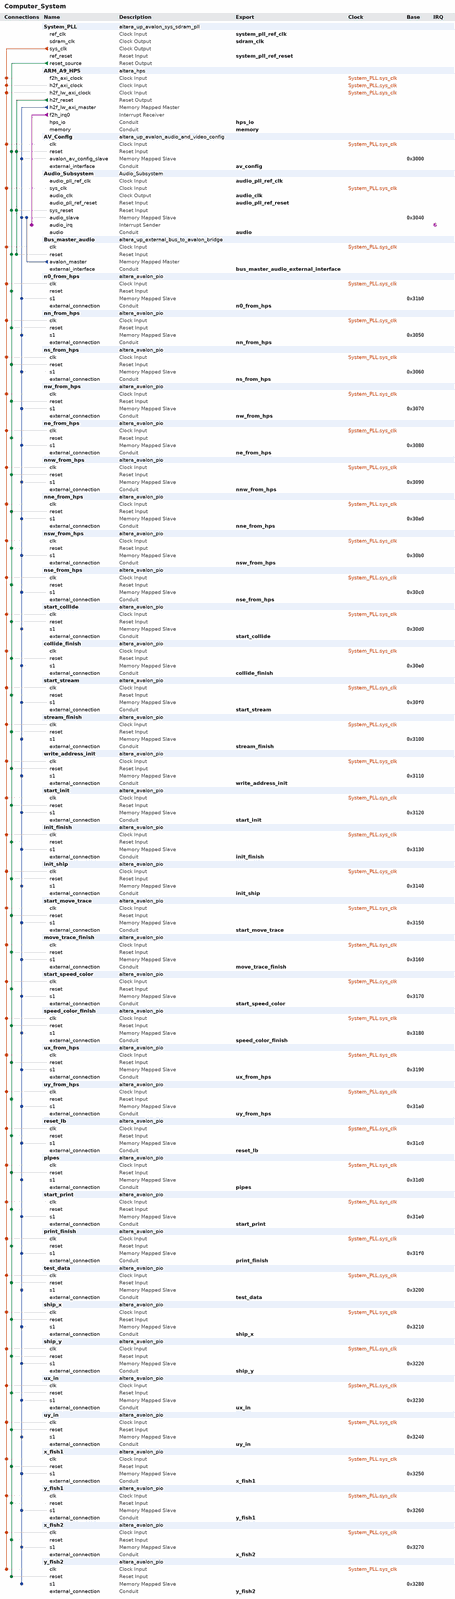
[diagram p0: system contents, whole]
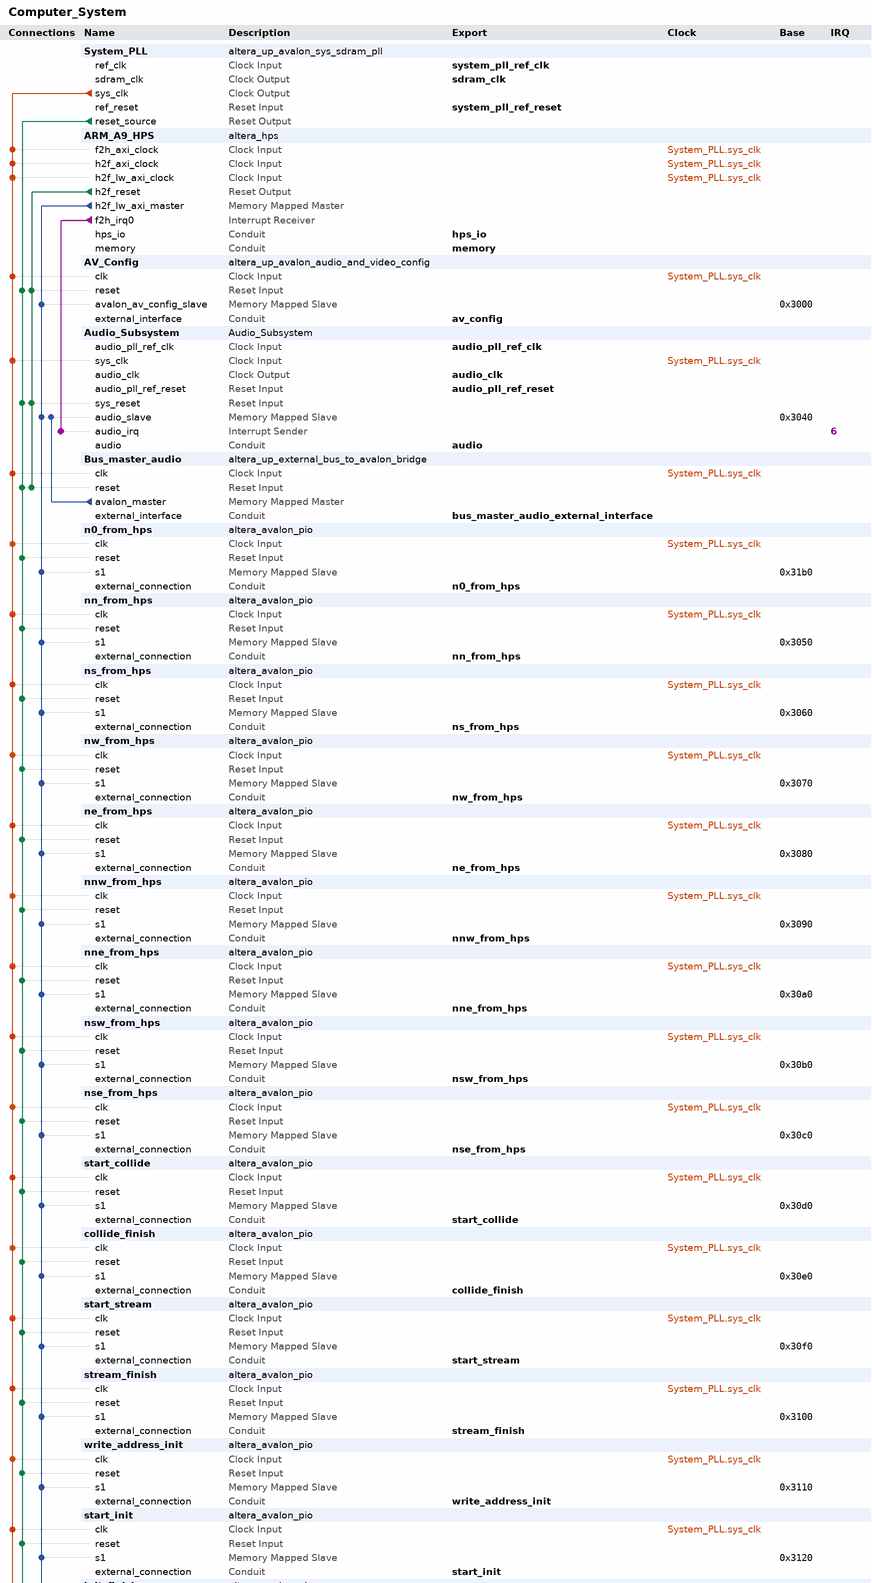
[diagram p1: system contents, upper part]
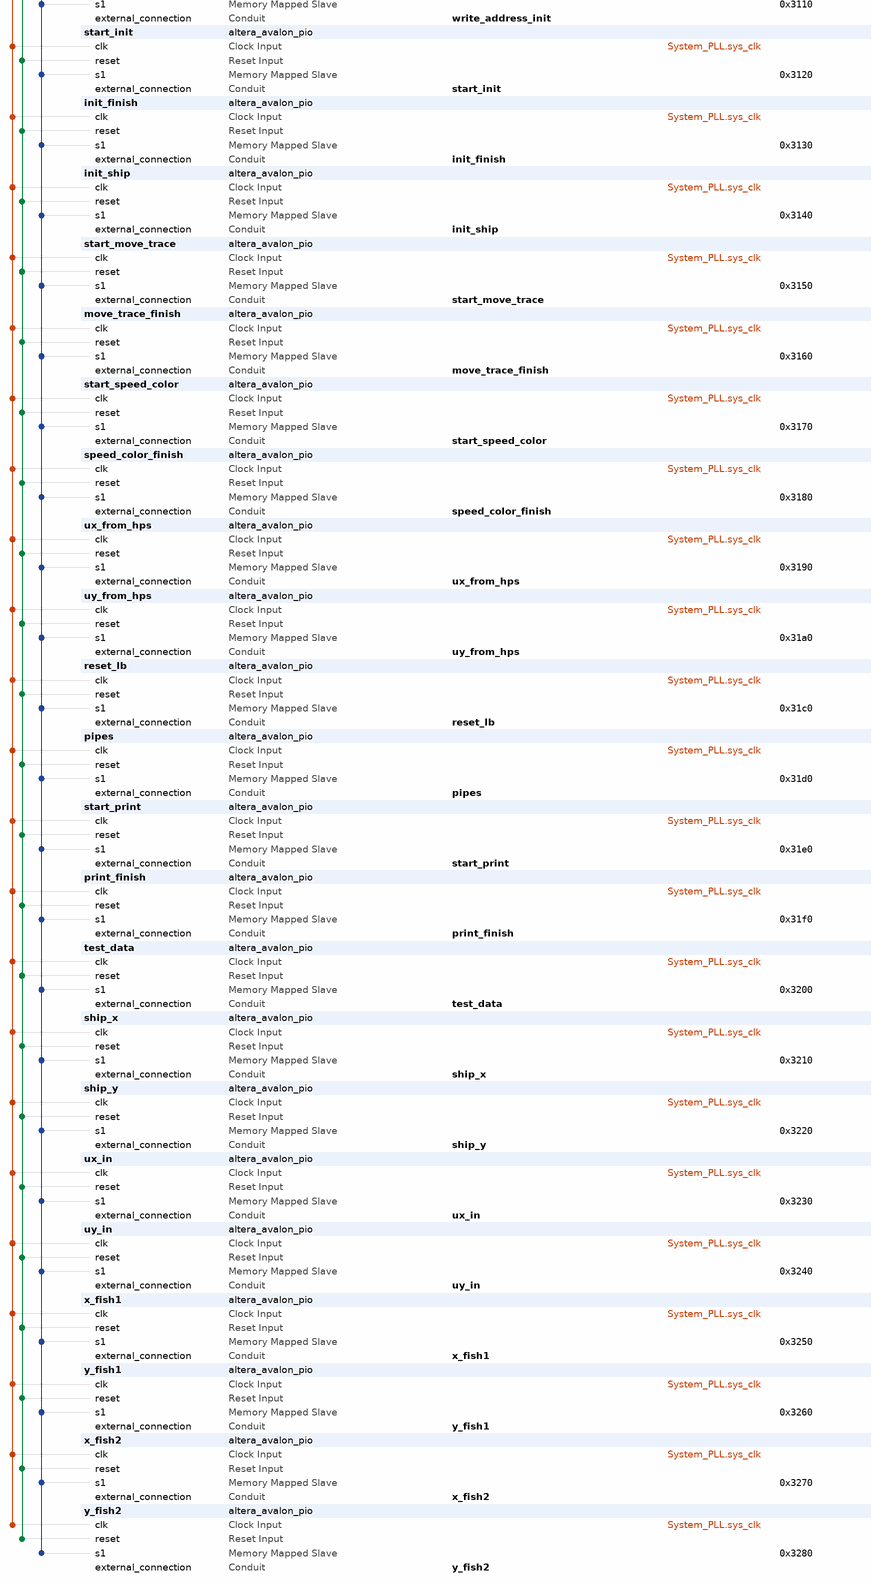
[diagram p2: system contents, lower part]
# Platform Designer (Qsys) system Computer_System, Cyclone V 5CSEMA5F31C6
# Parameters at their usual value, and those the tool derives, are not listed.
package require -exact qsys 18.1
create_system Computer_System
set_project_property DEVICE_FAMILY {Cyclone V}
set_project_property DEVICE 5CSEMA5F31C6

add_instance System_PLL altera_up_avalon_sys_sdram_pll 18.0
set_instance_parameter_value System_PLL CV_boards DE1-SoC
set_instance_parameter_value System_PLL gui_outclk 100.0
set_instance_parameter_value System_PLL gui_refclk 50.0

add_instance ARM_A9_HPS altera_hps 18.1
set_instance_parameter_value ARM_A9_HPS EMAC1_Mode RGMII
set_instance_parameter_value ARM_A9_HPS EMAC1_PinMuxing {HPS I/O Set 0}
set_instance_parameter_value ARM_A9_HPS F2SCLK_COLDRST_Enable false
set_instance_parameter_value ARM_A9_HPS F2SCLK_DBGRST_Enable false
set_instance_parameter_value ARM_A9_HPS F2SCLK_WARMRST_Enable false
set_instance_parameter_value ARM_A9_HPS F2SINTERRUPT_Enable true
set_instance_parameter_value ARM_A9_HPS F2S_Width 2
set_instance_parameter_value ARM_A9_HPS FPGA_PERIPHERAL_OUTPUT_CLOCK_FREQ_EMAC0_GTX_CLK 125
set_instance_parameter_value ARM_A9_HPS FPGA_PERIPHERAL_OUTPUT_CLOCK_FREQ_EMAC0_MD_CLK 100.0
set_instance_parameter_value ARM_A9_HPS FPGA_PERIPHERAL_OUTPUT_CLOCK_FREQ_EMAC1_GTX_CLK 125
set_instance_parameter_value ARM_A9_HPS FPGA_PERIPHERAL_OUTPUT_CLOCK_FREQ_EMAC1_MD_CLK 100.0
set_instance_parameter_value ARM_A9_HPS HPS_PROTOCOL DDR3
set_instance_parameter_value ARM_A9_HPS I2C0_Mode I2C
set_instance_parameter_value ARM_A9_HPS I2C0_PinMuxing {HPS I/O Set 0}
set_instance_parameter_value ARM_A9_HPS I2C1_Mode I2C
set_instance_parameter_value ARM_A9_HPS I2C1_PinMuxing {HPS I/O Set 0}
set_instance_parameter_value ARM_A9_HPS LWH2F_Enable true
set_instance_parameter_value ARM_A9_HPS MEM_BANKADDR_WIDTH 3
set_instance_parameter_value ARM_A9_HPS MEM_CLK_FREQ 400.0
set_instance_parameter_value ARM_A9_HPS MEM_COL_ADDR_WIDTH 10
set_instance_parameter_value ARM_A9_HPS MEM_DQ_WIDTH 32
set_instance_parameter_value ARM_A9_HPS MEM_DRV_STR RZQ/7
set_instance_parameter_value ARM_A9_HPS MEM_ROW_ADDR_WIDTH 15
set_instance_parameter_value ARM_A9_HPS MEM_RTT_NOM RZQ/4
set_instance_parameter_value ARM_A9_HPS MEM_RTT_WR RZQ/4
set_instance_parameter_value ARM_A9_HPS MEM_TCL 11
set_instance_parameter_value ARM_A9_HPS MEM_TFAW_NS 30.0
set_instance_parameter_value ARM_A9_HPS MEM_TRAS_NS 35.0
set_instance_parameter_value ARM_A9_HPS MEM_TRCD_NS 13.75
set_instance_parameter_value ARM_A9_HPS MEM_TRFC_NS 260.0
set_instance_parameter_value ARM_A9_HPS MEM_TRP_NS 13.75
set_instance_parameter_value ARM_A9_HPS MEM_VENDOR JEDEC
set_instance_parameter_value ARM_A9_HPS MEM_WTCL 8
set_instance_parameter_value ARM_A9_HPS QSPI_Mode {1 SS}
set_instance_parameter_value ARM_A9_HPS QSPI_PinMuxing {HPS I/O Set 0}
set_instance_parameter_value ARM_A9_HPS REF_CLK_FREQ 25.0
set_instance_parameter_value ARM_A9_HPS S2FCLK_USER2CLK 5
set_instance_parameter_value ARM_A9_HPS S2F_Width 3
set_instance_parameter_value ARM_A9_HPS SDIO_Mode {4-bit Data}
set_instance_parameter_value ARM_A9_HPS SDIO_PinMuxing {HPS I/O Set 0}
set_instance_parameter_value ARM_A9_HPS SPIM1_Mode {Single Slave Select}
set_instance_parameter_value ARM_A9_HPS SPIM1_PinMuxing {HPS I/O Set 0}
set_instance_parameter_value ARM_A9_HPS STM_Enable false
set_instance_parameter_value ARM_A9_HPS TIMING_BOARD_AC_SKEW 0.03
set_instance_parameter_value ARM_A9_HPS TIMING_BOARD_AC_TO_CK_SKEW 0.0
set_instance_parameter_value ARM_A9_HPS TIMING_BOARD_DQ_TO_DQS_SKEW 0.0
set_instance_parameter_value ARM_A9_HPS TIMING_BOARD_MAX_CK_DELAY 0.03
set_instance_parameter_value ARM_A9_HPS TIMING_BOARD_MAX_DQS_DELAY 0.02
set_instance_parameter_value ARM_A9_HPS TIMING_BOARD_SKEW_BETWEEN_DQS 0.08
set_instance_parameter_value ARM_A9_HPS TIMING_BOARD_SKEW_CKDQS_DIMM_MAX 0.16
set_instance_parameter_value ARM_A9_HPS TIMING_BOARD_SKEW_CKDQS_DIMM_MIN 0.09
set_instance_parameter_value ARM_A9_HPS TIMING_BOARD_SKEW_WITHIN_DQS 0.01
set_instance_parameter_value ARM_A9_HPS TIMING_TDH 65
set_instance_parameter_value ARM_A9_HPS TIMING_TDQSCK 255
set_instance_parameter_value ARM_A9_HPS TIMING_TDQSQ 125
set_instance_parameter_value ARM_A9_HPS TIMING_TDS 30
set_instance_parameter_value ARM_A9_HPS TIMING_TIH 140
set_instance_parameter_value ARM_A9_HPS TIMING_TIS 180
set_instance_parameter_value ARM_A9_HPS TIMING_TQSH 0.4
set_instance_parameter_value ARM_A9_HPS UART0_Mode {No Flow Control}
set_instance_parameter_value ARM_A9_HPS UART0_PinMuxing {HPS I/O Set 0}
set_instance_parameter_value ARM_A9_HPS USB1_Mode SDR
set_instance_parameter_value ARM_A9_HPS USB1_PinMuxing {HPS I/O Set 0}
set_instance_parameter_value ARM_A9_HPS desired_cfg_clk_mhz 100.0
set_instance_parameter_value ARM_A9_HPS desired_qspi_clk_mhz 400.0

add_instance AV_Config altera_up_avalon_audio_and_video_config 18.0
set_instance_parameter_value AV_Config audio_in {Microphone to ADC}
set_instance_parameter_value AV_Config bit_length 32
set_instance_parameter_value AV_Config board DE1-SoC
set_instance_parameter_value AV_Config line_in_bypass true
set_instance_parameter_value AV_Config sampling_rate {48 kHz}

add_instance Audio_Subsystem Audio_Subsystem 1.0

add_instance Bus_master_audio altera_up_external_bus_to_avalon_bridge 18.0
set_instance_parameter_value Bus_master_audio addr_size 64
set_instance_parameter_value Bus_master_audio addr_size_multiplier Kbytes
set_instance_parameter_value Bus_master_audio data_size 32

add_instance n0_from_hps altera_avalon_pio 18.1
set_instance_parameter_value n0_from_hps direction Output
set_instance_parameter_value n0_from_hps width 32

add_instance nn_from_hps altera_avalon_pio 18.1
set_instance_parameter_value nn_from_hps direction Output
set_instance_parameter_value nn_from_hps width 32

add_instance ns_from_hps altera_avalon_pio 18.1
set_instance_parameter_value ns_from_hps direction Output
set_instance_parameter_value ns_from_hps width 32

add_instance nw_from_hps altera_avalon_pio 18.1
set_instance_parameter_value nw_from_hps direction Output
set_instance_parameter_value nw_from_hps width 32

add_instance ne_from_hps altera_avalon_pio 18.1
set_instance_parameter_value ne_from_hps direction Output
set_instance_parameter_value ne_from_hps width 32

add_instance nnw_from_hps altera_avalon_pio 18.1
set_instance_parameter_value nnw_from_hps direction Output
set_instance_parameter_value nnw_from_hps width 32

add_instance nne_from_hps altera_avalon_pio 18.1
set_instance_parameter_value nne_from_hps direction Output
set_instance_parameter_value nne_from_hps width 32

add_instance nsw_from_hps altera_avalon_pio 18.1
set_instance_parameter_value nsw_from_hps direction Output
set_instance_parameter_value nsw_from_hps width 32

add_instance nse_from_hps altera_avalon_pio 18.1
set_instance_parameter_value nse_from_hps direction Output
set_instance_parameter_value nse_from_hps width 32

add_instance start_collide altera_avalon_pio 18.1
set_instance_parameter_value start_collide direction Output
set_instance_parameter_value start_collide width 32

add_instance collide_finish altera_avalon_pio 18.1
set_instance_parameter_value collide_finish direction Input
set_instance_parameter_value collide_finish width 32

add_instance start_stream altera_avalon_pio 18.1
set_instance_parameter_value start_stream direction Output
set_instance_parameter_value start_stream width 32

add_instance stream_finish altera_avalon_pio 18.1
set_instance_parameter_value stream_finish direction Input
set_instance_parameter_value stream_finish width 32

add_instance write_address_init altera_avalon_pio 18.1
set_instance_parameter_value write_address_init direction Output
set_instance_parameter_value write_address_init width 32

add_instance start_init altera_avalon_pio 18.1
set_instance_parameter_value start_init direction Output
set_instance_parameter_value start_init width 32

add_instance init_finish altera_avalon_pio 18.1
set_instance_parameter_value init_finish direction Input
set_instance_parameter_value init_finish width 32

add_instance init_ship altera_avalon_pio 18.1
set_instance_parameter_value init_ship direction Output
set_instance_parameter_value init_ship width 32

add_instance start_move_trace altera_avalon_pio 18.1
set_instance_parameter_value start_move_trace direction Output
set_instance_parameter_value start_move_trace width 32

add_instance move_trace_finish altera_avalon_pio 18.1
set_instance_parameter_value move_trace_finish direction Input
set_instance_parameter_value move_trace_finish width 32

add_instance start_speed_color altera_avalon_pio 18.1
set_instance_parameter_value start_speed_color direction Output
set_instance_parameter_value start_speed_color width 32

add_instance speed_color_finish altera_avalon_pio 18.1
set_instance_parameter_value speed_color_finish direction Input
set_instance_parameter_value speed_color_finish width 32

add_instance ux_from_hps altera_avalon_pio 18.1
set_instance_parameter_value ux_from_hps direction Output
set_instance_parameter_value ux_from_hps width 32

add_instance uy_from_hps altera_avalon_pio 18.1
set_instance_parameter_value uy_from_hps direction Output
set_instance_parameter_value uy_from_hps width 32

add_instance reset_lb altera_avalon_pio 18.1
set_instance_parameter_value reset_lb direction Output
set_instance_parameter_value reset_lb width 32

add_instance pipes altera_avalon_pio 18.1
set_instance_parameter_value pipes direction Input
set_instance_parameter_value pipes width 32

add_instance start_print altera_avalon_pio 18.1
set_instance_parameter_value start_print direction Output
set_instance_parameter_value start_print width 32

add_instance print_finish altera_avalon_pio 18.1
set_instance_parameter_value print_finish direction Input
set_instance_parameter_value print_finish width 32

add_instance test_data altera_avalon_pio 18.1
set_instance_parameter_value test_data direction Output
set_instance_parameter_value test_data width 32

add_instance ship_x altera_avalon_pio 18.1
set_instance_parameter_value ship_x direction Output
set_instance_parameter_value ship_x width 32

add_instance ship_y altera_avalon_pio 18.1
set_instance_parameter_value ship_y direction Output
set_instance_parameter_value ship_y width 32

add_instance ux_in altera_avalon_pio 18.1
set_instance_parameter_value ux_in direction Input
set_instance_parameter_value ux_in width 32

add_instance uy_in altera_avalon_pio 18.1
set_instance_parameter_value uy_in direction Input
set_instance_parameter_value uy_in width 32

add_instance x_fish1 altera_avalon_pio 18.1
set_instance_parameter_value x_fish1 direction Output
set_instance_parameter_value x_fish1 width 32

add_instance y_fish1 altera_avalon_pio 18.1
set_instance_parameter_value y_fish1 direction Output
set_instance_parameter_value y_fish1 width 32

add_instance x_fish2 altera_avalon_pio 18.1
set_instance_parameter_value x_fish2 direction Output
set_instance_parameter_value x_fish2 width 32

add_instance y_fish2 altera_avalon_pio 18.1
set_instance_parameter_value y_fish2 direction Output
set_instance_parameter_value y_fish2 width 32

# connections
add_connection System_PLL.sys_clk ARM_A9_HPS.f2h_axi_clock clock
add_connection System_PLL.sys_clk ARM_A9_HPS.h2f_axi_clock clock
add_connection System_PLL.sys_clk ARM_A9_HPS.h2f_lw_axi_clock clock
add_connection System_PLL.sys_clk Audio_Subsystem.sys_clk clock
add_connection System_PLL.sys_clk AV_Config.clk clock
add_connection System_PLL.sys_clk Bus_master_audio.clk clock
add_connection System_PLL.sys_clk collide_finish.clk clock
add_connection System_PLL.sys_clk init_finish.clk clock
add_connection System_PLL.sys_clk init_ship.clk clock
add_connection System_PLL.sys_clk move_trace_finish.clk clock
add_connection System_PLL.sys_clk n0_from_hps.clk clock
add_connection System_PLL.sys_clk ne_from_hps.clk clock
add_connection System_PLL.sys_clk nn_from_hps.clk clock
add_connection System_PLL.sys_clk nne_from_hps.clk clock
add_connection System_PLL.sys_clk nnw_from_hps.clk clock
add_connection System_PLL.sys_clk ns_from_hps.clk clock
add_connection System_PLL.sys_clk nse_from_hps.clk clock
add_connection System_PLL.sys_clk nsw_from_hps.clk clock
add_connection System_PLL.sys_clk nw_from_hps.clk clock
add_connection System_PLL.sys_clk pipes.clk clock
add_connection System_PLL.sys_clk print_finish.clk clock
add_connection System_PLL.sys_clk reset_lb.clk clock
add_connection System_PLL.sys_clk ship_x.clk clock
add_connection System_PLL.sys_clk ship_y.clk clock
add_connection System_PLL.sys_clk speed_color_finish.clk clock
add_connection System_PLL.sys_clk start_collide.clk clock
add_connection System_PLL.sys_clk start_init.clk clock
add_connection System_PLL.sys_clk start_move_trace.clk clock
add_connection System_PLL.sys_clk start_print.clk clock
add_connection System_PLL.sys_clk start_speed_color.clk clock
add_connection System_PLL.sys_clk start_stream.clk clock
add_connection System_PLL.sys_clk stream_finish.clk clock
add_connection System_PLL.sys_clk test_data.clk clock
add_connection System_PLL.sys_clk ux_from_hps.clk clock
add_connection System_PLL.sys_clk ux_in.clk clock
add_connection System_PLL.sys_clk uy_from_hps.clk clock
add_connection System_PLL.sys_clk uy_in.clk clock
add_connection System_PLL.sys_clk write_address_init.clk clock
add_connection System_PLL.sys_clk x_fish1.clk clock
add_connection System_PLL.sys_clk x_fish2.clk clock
add_connection System_PLL.sys_clk y_fish1.clk clock
add_connection System_PLL.sys_clk y_fish2.clk clock
add_connection ARM_A9_HPS.h2f_reset Audio_Subsystem.sys_reset reset
add_connection ARM_A9_HPS.h2f_reset AV_Config.reset reset
add_connection ARM_A9_HPS.h2f_reset Bus_master_audio.reset reset
add_connection System_PLL.reset_source Audio_Subsystem.sys_reset reset
add_connection System_PLL.reset_source AV_Config.reset reset
add_connection System_PLL.reset_source Bus_master_audio.reset reset
add_connection System_PLL.reset_source collide_finish.reset reset
add_connection System_PLL.reset_source init_finish.reset reset
add_connection System_PLL.reset_source init_ship.reset reset
add_connection System_PLL.reset_source move_trace_finish.reset reset
add_connection System_PLL.reset_source n0_from_hps.reset reset
add_connection System_PLL.reset_source ne_from_hps.reset reset
add_connection System_PLL.reset_source nn_from_hps.reset reset
add_connection System_PLL.reset_source nne_from_hps.reset reset
add_connection System_PLL.reset_source nnw_from_hps.reset reset
add_connection System_PLL.reset_source ns_from_hps.reset reset
add_connection System_PLL.reset_source nse_from_hps.reset reset
add_connection System_PLL.reset_source nsw_from_hps.reset reset
add_connection System_PLL.reset_source nw_from_hps.reset reset
add_connection System_PLL.reset_source pipes.reset reset
add_connection System_PLL.reset_source print_finish.reset reset
add_connection System_PLL.reset_source reset_lb.reset reset
add_connection System_PLL.reset_source ship_x.reset reset
add_connection System_PLL.reset_source ship_y.reset reset
add_connection System_PLL.reset_source speed_color_finish.reset reset
add_connection System_PLL.reset_source start_collide.reset reset
add_connection System_PLL.reset_source start_init.reset reset
add_connection System_PLL.reset_source start_move_trace.reset reset
add_connection System_PLL.reset_source start_print.reset reset
add_connection System_PLL.reset_source start_speed_color.reset reset
add_connection System_PLL.reset_source start_stream.reset reset
add_connection System_PLL.reset_source stream_finish.reset reset
add_connection System_PLL.reset_source test_data.reset reset
add_connection System_PLL.reset_source ux_from_hps.reset reset
add_connection System_PLL.reset_source ux_in.reset reset
add_connection System_PLL.reset_source uy_from_hps.reset reset
add_connection System_PLL.reset_source uy_in.reset reset
add_connection System_PLL.reset_source write_address_init.reset reset
add_connection System_PLL.reset_source x_fish1.reset reset
add_connection System_PLL.reset_source x_fish2.reset reset
add_connection System_PLL.reset_source y_fish1.reset reset
add_connection System_PLL.reset_source y_fish2.reset reset
add_connection ARM_A9_HPS.h2f_lw_axi_master Audio_Subsystem.audio_slave avalon
set_connection_parameter_value ARM_A9_HPS.h2f_lw_axi_master/Audio_Subsystem.audio_slave baseAddress 0x3040
add_connection ARM_A9_HPS.h2f_lw_axi_master AV_Config.avalon_av_config_slave avalon
set_connection_parameter_value ARM_A9_HPS.h2f_lw_axi_master/AV_Config.avalon_av_config_slave baseAddress 0x3000
add_connection ARM_A9_HPS.h2f_lw_axi_master collide_finish.s1 avalon
set_connection_parameter_value ARM_A9_HPS.h2f_lw_axi_master/collide_finish.s1 baseAddress 0x30e0
add_connection ARM_A9_HPS.h2f_lw_axi_master init_finish.s1 avalon
set_connection_parameter_value ARM_A9_HPS.h2f_lw_axi_master/init_finish.s1 baseAddress 0x3130
add_connection ARM_A9_HPS.h2f_lw_axi_master init_ship.s1 avalon
set_connection_parameter_value ARM_A9_HPS.h2f_lw_axi_master/init_ship.s1 baseAddress 0x3140
add_connection ARM_A9_HPS.h2f_lw_axi_master move_trace_finish.s1 avalon
set_connection_parameter_value ARM_A9_HPS.h2f_lw_axi_master/move_trace_finish.s1 baseAddress 0x3160
add_connection ARM_A9_HPS.h2f_lw_axi_master n0_from_hps.s1 avalon
set_connection_parameter_value ARM_A9_HPS.h2f_lw_axi_master/n0_from_hps.s1 baseAddress 0x31b0
add_connection ARM_A9_HPS.h2f_lw_axi_master ne_from_hps.s1 avalon
set_connection_parameter_value ARM_A9_HPS.h2f_lw_axi_master/ne_from_hps.s1 baseAddress 0x3080
add_connection ARM_A9_HPS.h2f_lw_axi_master nn_from_hps.s1 avalon
set_connection_parameter_value ARM_A9_HPS.h2f_lw_axi_master/nn_from_hps.s1 baseAddress 0x3050
add_connection ARM_A9_HPS.h2f_lw_axi_master nne_from_hps.s1 avalon
set_connection_parameter_value ARM_A9_HPS.h2f_lw_axi_master/nne_from_hps.s1 baseAddress 0x30a0
add_connection ARM_A9_HPS.h2f_lw_axi_master nnw_from_hps.s1 avalon
set_connection_parameter_value ARM_A9_HPS.h2f_lw_axi_master/nnw_from_hps.s1 baseAddress 0x3090
add_connection ARM_A9_HPS.h2f_lw_axi_master ns_from_hps.s1 avalon
set_connection_parameter_value ARM_A9_HPS.h2f_lw_axi_master/ns_from_hps.s1 baseAddress 0x3060
add_connection ARM_A9_HPS.h2f_lw_axi_master nse_from_hps.s1 avalon
set_connection_parameter_value ARM_A9_HPS.h2f_lw_axi_master/nse_from_hps.s1 baseAddress 0x30c0
add_connection ARM_A9_HPS.h2f_lw_axi_master nsw_from_hps.s1 avalon
set_connection_parameter_value ARM_A9_HPS.h2f_lw_axi_master/nsw_from_hps.s1 baseAddress 0x30b0
add_connection ARM_A9_HPS.h2f_lw_axi_master nw_from_hps.s1 avalon
set_connection_parameter_value ARM_A9_HPS.h2f_lw_axi_master/nw_from_hps.s1 baseAddress 0x3070
add_connection ARM_A9_HPS.h2f_lw_axi_master pipes.s1 avalon
set_connection_parameter_value ARM_A9_HPS.h2f_lw_axi_master/pipes.s1 baseAddress 0x31d0
add_connection ARM_A9_HPS.h2f_lw_axi_master print_finish.s1 avalon
set_connection_parameter_value ARM_A9_HPS.h2f_lw_axi_master/print_finish.s1 baseAddress 0x31f0
add_connection ARM_A9_HPS.h2f_lw_axi_master reset_lb.s1 avalon
set_connection_parameter_value ARM_A9_HPS.h2f_lw_axi_master/reset_lb.s1 baseAddress 0x31c0
add_connection ARM_A9_HPS.h2f_lw_axi_master ship_x.s1 avalon
set_connection_parameter_value ARM_A9_HPS.h2f_lw_axi_master/ship_x.s1 baseAddress 0x3210
add_connection ARM_A9_HPS.h2f_lw_axi_master ship_y.s1 avalon
set_connection_parameter_value ARM_A9_HPS.h2f_lw_axi_master/ship_y.s1 baseAddress 0x3220
add_connection ARM_A9_HPS.h2f_lw_axi_master speed_color_finish.s1 avalon
set_connection_parameter_value ARM_A9_HPS.h2f_lw_axi_master/speed_color_finish.s1 baseAddress 0x3180
add_connection ARM_A9_HPS.h2f_lw_axi_master start_collide.s1 avalon
set_connection_parameter_value ARM_A9_HPS.h2f_lw_axi_master/start_collide.s1 baseAddress 0x30d0
add_connection ARM_A9_HPS.h2f_lw_axi_master start_init.s1 avalon
set_connection_parameter_value ARM_A9_HPS.h2f_lw_axi_master/start_init.s1 baseAddress 0x3120
add_connection ARM_A9_HPS.h2f_lw_axi_master start_move_trace.s1 avalon
set_connection_parameter_value ARM_A9_HPS.h2f_lw_axi_master/start_move_trace.s1 baseAddress 0x3150
add_connection ARM_A9_HPS.h2f_lw_axi_master start_print.s1 avalon
set_connection_parameter_value ARM_A9_HPS.h2f_lw_axi_master/start_print.s1 baseAddress 0x31e0
add_connection ARM_A9_HPS.h2f_lw_axi_master start_speed_color.s1 avalon
set_connection_parameter_value ARM_A9_HPS.h2f_lw_axi_master/start_speed_color.s1 baseAddress 0x3170
add_connection ARM_A9_HPS.h2f_lw_axi_master start_stream.s1 avalon
set_connection_parameter_value ARM_A9_HPS.h2f_lw_axi_master/start_stream.s1 baseAddress 0x30f0
add_connection ARM_A9_HPS.h2f_lw_axi_master stream_finish.s1 avalon
set_connection_parameter_value ARM_A9_HPS.h2f_lw_axi_master/stream_finish.s1 baseAddress 0x3100
add_connection ARM_A9_HPS.h2f_lw_axi_master test_data.s1 avalon
set_connection_parameter_value ARM_A9_HPS.h2f_lw_axi_master/test_data.s1 baseAddress 0x3200
add_connection ARM_A9_HPS.h2f_lw_axi_master ux_from_hps.s1 avalon
set_connection_parameter_value ARM_A9_HPS.h2f_lw_axi_master/ux_from_hps.s1 baseAddress 0x3190
add_connection ARM_A9_HPS.h2f_lw_axi_master ux_in.s1 avalon
set_connection_parameter_value ARM_A9_HPS.h2f_lw_axi_master/ux_in.s1 baseAddress 0x3230
add_connection ARM_A9_HPS.h2f_lw_axi_master uy_from_hps.s1 avalon
set_connection_parameter_value ARM_A9_HPS.h2f_lw_axi_master/uy_from_hps.s1 baseAddress 0x31a0
add_connection ARM_A9_HPS.h2f_lw_axi_master uy_in.s1 avalon
set_connection_parameter_value ARM_A9_HPS.h2f_lw_axi_master/uy_in.s1 baseAddress 0x3240
add_connection ARM_A9_HPS.h2f_lw_axi_master write_address_init.s1 avalon
set_connection_parameter_value ARM_A9_HPS.h2f_lw_axi_master/write_address_init.s1 baseAddress 0x3110
add_connection ARM_A9_HPS.h2f_lw_axi_master x_fish1.s1 avalon
set_connection_parameter_value ARM_A9_HPS.h2f_lw_axi_master/x_fish1.s1 baseAddress 0x3250
add_connection ARM_A9_HPS.h2f_lw_axi_master x_fish2.s1 avalon
set_connection_parameter_value ARM_A9_HPS.h2f_lw_axi_master/x_fish2.s1 baseAddress 0x3270
add_connection ARM_A9_HPS.h2f_lw_axi_master y_fish1.s1 avalon
set_connection_parameter_value ARM_A9_HPS.h2f_lw_axi_master/y_fish1.s1 baseAddress 0x3260
add_connection ARM_A9_HPS.h2f_lw_axi_master y_fish2.s1 avalon
set_connection_parameter_value ARM_A9_HPS.h2f_lw_axi_master/y_fish2.s1 baseAddress 0x3280
add_connection Bus_master_audio.avalon_master Audio_Subsystem.audio_slave avalon
set_connection_parameter_value Bus_master_audio.avalon_master/Audio_Subsystem.audio_slave baseAddress 0x3040
add_connection ARM_A9_HPS.f2h_irq0 Audio_Subsystem.audio_irq interrupt
set_connection_parameter_value ARM_A9_HPS.f2h_irq0/Audio_Subsystem.audio_irq irqNumber 6

# exported interfaces
add_interface audio conduit end
set_interface_property audio EXPORT_OF Audio_Subsystem.audio
add_interface audio_clk clock source
set_interface_property audio_clk EXPORT_OF Audio_Subsystem.audio_clk
add_interface audio_pll_ref_clk clock sink
set_interface_property audio_pll_ref_clk EXPORT_OF Audio_Subsystem.audio_pll_ref_clk
add_interface audio_pll_ref_reset reset sink
set_interface_property audio_pll_ref_reset EXPORT_OF Audio_Subsystem.audio_pll_ref_reset
add_interface av_config conduit end
set_interface_property av_config EXPORT_OF AV_Config.external_interface
add_interface bus_master_audio_external_interface conduit end
set_interface_property bus_master_audio_external_interface EXPORT_OF Bus_master_audio.external_interface
add_interface collide_finish conduit end
set_interface_property collide_finish EXPORT_OF collide_finish.external_connection
add_interface hps_io conduit end
set_interface_property hps_io EXPORT_OF ARM_A9_HPS.hps_io
add_interface init_finish conduit end
set_interface_property init_finish EXPORT_OF init_finish.external_connection
add_interface init_ship conduit end
set_interface_property init_ship EXPORT_OF init_ship.external_connection
add_interface memory conduit end
set_interface_property memory EXPORT_OF ARM_A9_HPS.memory
add_interface move_trace_finish conduit end
set_interface_property move_trace_finish EXPORT_OF move_trace_finish.external_connection
add_interface n0_from_hps conduit end
set_interface_property n0_from_hps EXPORT_OF n0_from_hps.external_connection
add_interface ne_from_hps conduit end
set_interface_property ne_from_hps EXPORT_OF ne_from_hps.external_connection
add_interface nn_from_hps conduit end
set_interface_property nn_from_hps EXPORT_OF nn_from_hps.external_connection
add_interface nne_from_hps conduit end
set_interface_property nne_from_hps EXPORT_OF nne_from_hps.external_connection
add_interface nnw_from_hps conduit end
set_interface_property nnw_from_hps EXPORT_OF nnw_from_hps.external_connection
add_interface ns_from_hps conduit end
set_interface_property ns_from_hps EXPORT_OF ns_from_hps.external_connection
add_interface nse_from_hps conduit end
set_interface_property nse_from_hps EXPORT_OF nse_from_hps.external_connection
add_interface nsw_from_hps conduit end
set_interface_property nsw_from_hps EXPORT_OF nsw_from_hps.external_connection
add_interface nw_from_hps conduit end
set_interface_property nw_from_hps EXPORT_OF nw_from_hps.external_connection
add_interface pipes conduit end
set_interface_property pipes EXPORT_OF pipes.external_connection
add_interface print_finish conduit end
set_interface_property print_finish EXPORT_OF print_finish.external_connection
add_interface reset_lb conduit end
set_interface_property reset_lb EXPORT_OF reset_lb.external_connection
add_interface sdram_clk clock source
set_interface_property sdram_clk EXPORT_OF System_PLL.sdram_clk
add_interface ship_x conduit end
set_interface_property ship_x EXPORT_OF ship_x.external_connection
add_interface ship_y conduit end
set_interface_property ship_y EXPORT_OF ship_y.external_connection
add_interface speed_color_finish conduit end
set_interface_property speed_color_finish EXPORT_OF speed_color_finish.external_connection
add_interface start_collide conduit end
set_interface_property start_collide EXPORT_OF start_collide.external_connection
add_interface start_init conduit end
set_interface_property start_init EXPORT_OF start_init.external_connection
add_interface start_move_trace conduit end
set_interface_property start_move_trace EXPORT_OF start_move_trace.external_connection
add_interface start_print conduit end
set_interface_property start_print EXPORT_OF start_print.external_connection
add_interface start_speed_color conduit end
set_interface_property start_speed_color EXPORT_OF start_speed_color.external_connection
add_interface start_stream conduit end
set_interface_property start_stream EXPORT_OF start_stream.external_connection
add_interface stream_finish conduit end
set_interface_property stream_finish EXPORT_OF stream_finish.external_connection
add_interface system_pll_ref_clk clock sink
set_interface_property system_pll_ref_clk EXPORT_OF System_PLL.ref_clk
add_interface system_pll_ref_reset reset sink
set_interface_property system_pll_ref_reset EXPORT_OF System_PLL.ref_reset
add_interface test_data conduit end
set_interface_property test_data EXPORT_OF test_data.external_connection
add_interface ux_from_hps conduit end
set_interface_property ux_from_hps EXPORT_OF ux_from_hps.external_connection
add_interface ux_in conduit end
set_interface_property ux_in EXPORT_OF ux_in.external_connection
add_interface uy_from_hps conduit end
set_interface_property uy_from_hps EXPORT_OF uy_from_hps.external_connection
add_interface uy_in conduit end
set_interface_property uy_in EXPORT_OF uy_in.external_connection
add_interface write_address_init conduit end
set_interface_property write_address_init EXPORT_OF write_address_init.external_connection
add_interface x_fish1 conduit end
set_interface_property x_fish1 EXPORT_OF x_fish1.external_connection
add_interface x_fish2 conduit end
set_interface_property x_fish2 EXPORT_OF x_fish2.external_connection
add_interface y_fish1 conduit end
set_interface_property y_fish1 EXPORT_OF y_fish1.external_connection
add_interface y_fish2 conduit end
set_interface_property y_fish2 EXPORT_OF y_fish2.external_connection

set_interconnect_requirement {$system} qsys_mm.clockCrossingAdapter HANDSHAKE
set_interconnect_requirement {$system} qsys_mm.enableEccProtection FALSE
set_interconnect_requirement {$system} qsys_mm.insertDefaultSlave FALSE
set_interconnect_requirement {$system} qsys_mm.maxAdditionalLatency 1

save_system Computer_System.qsys
